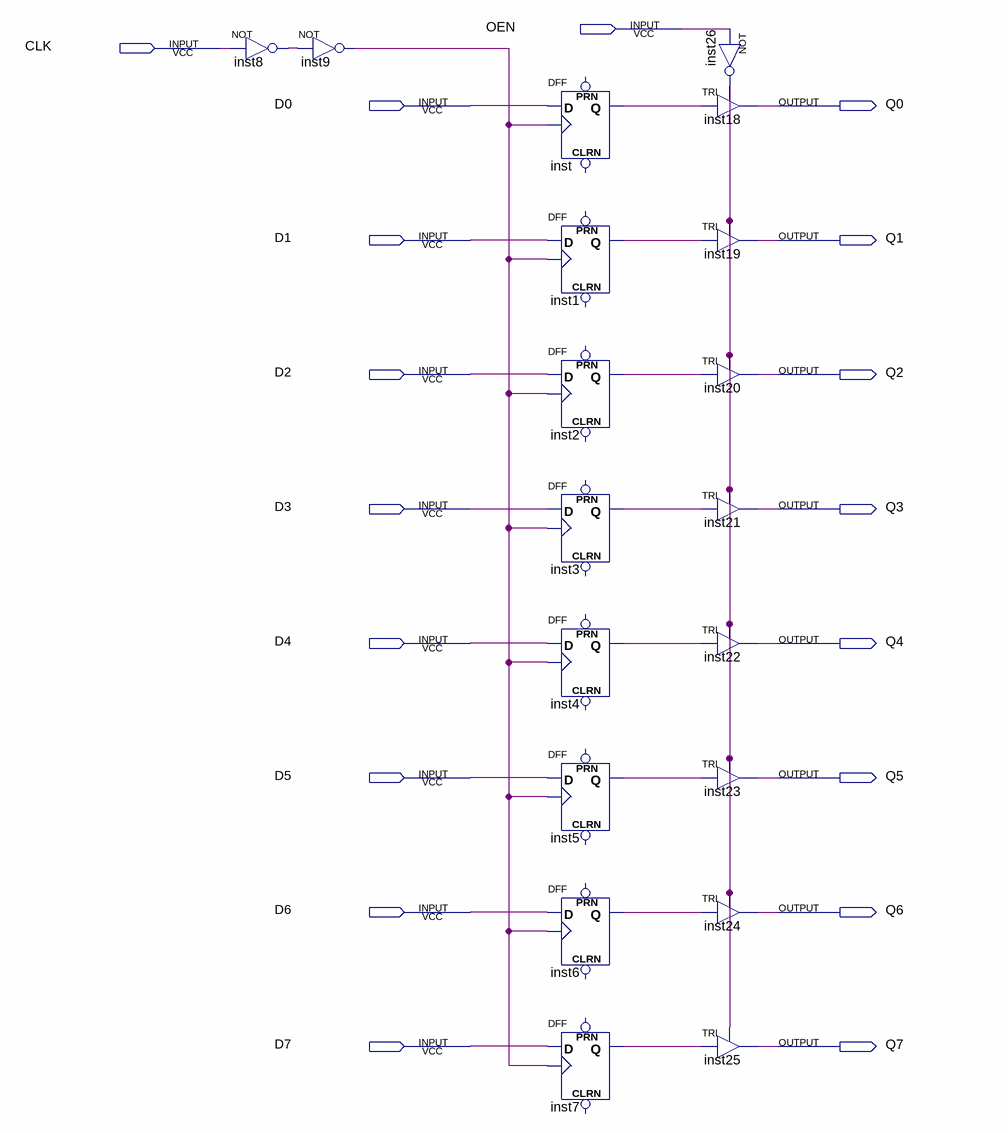
[diagram p0: schematic sheet]
// Quartus schematic ALP174xx374.bdf as structural Verilog: 19 symbols, 18 pins
module ALP174xx374 (
  input  OEN,
  input  CLK,
  input  D0,
  input  D1,
  input  D2,
  input  D3,
  input  D4,
  input  D5,
  input  D6,
  input  D7,
  output Q0,
  output Q1,
  output Q2,
  output Q3,
  output Q4,
  output Q5,
  output Q6,
  output Q7
);

  wire inst1_q, inst2_q, inst3_q, inst4_q, inst5_q, inst6_q, inst7_q, inst8_out, inst9_out, inst26_out,
       inst_q;

  not inst8 (inst8_out, CLK);
  not inst9 (inst9_out, inst8_out);
  DFF inst (.CLK(inst9_out), .D(D0), .Q(inst_q));  // open: CLRN, PRN
  DFF inst1 (.CLK(inst9_out), .D(D1), .Q(inst1_q));  // open: CLRN, PRN
  DFF inst2 (.CLK(inst9_out), .D(D2), .Q(inst2_q));  // open: CLRN, PRN
  DFF inst3 (.CLK(inst9_out), .D(D3), .Q(inst3_q));  // open: CLRN, PRN
  DFF inst4 (.CLK(inst9_out), .D(D4), .Q(inst4_q));  // open: CLRN, PRN
  DFF inst5 (.CLK(inst9_out), .D(D5), .Q(inst5_q));  // open: CLRN, PRN
  DFF inst6 (.CLK(inst9_out), .D(D6), .Q(inst6_q));  // open: CLRN, PRN
  DFF inst7 (.CLK(inst9_out), .D(D7), .Q(inst7_q));  // open: CLRN, PRN
  not inst26 (inst26_out, OEN);
  TRI inst18 (.IN(inst_q), .OE(inst26_out), .OUT(Q0));
  TRI inst19 (.IN(inst1_q), .OE(inst26_out), .OUT(Q1));
  TRI inst20 (.IN(inst2_q), .OE(inst26_out), .OUT(Q2));
  TRI inst21 (.IN(inst3_q), .OE(inst26_out), .OUT(Q3));
  TRI inst22 (.IN(inst4_q), .OE(inst26_out), .OUT(Q4));
  TRI inst23 (.IN(inst5_q), .OE(inst26_out), .OUT(Q5));
  TRI inst24 (.IN(inst6_q), .OE(inst26_out), .OUT(Q6));
  TRI inst25 (.IN(inst7_q), .OE(inst26_out), .OUT(Q7));
endmodule
